# Altium schematic sheet SD.SchDoc
size A; SheetNumber: 4; SheetTotal: 9
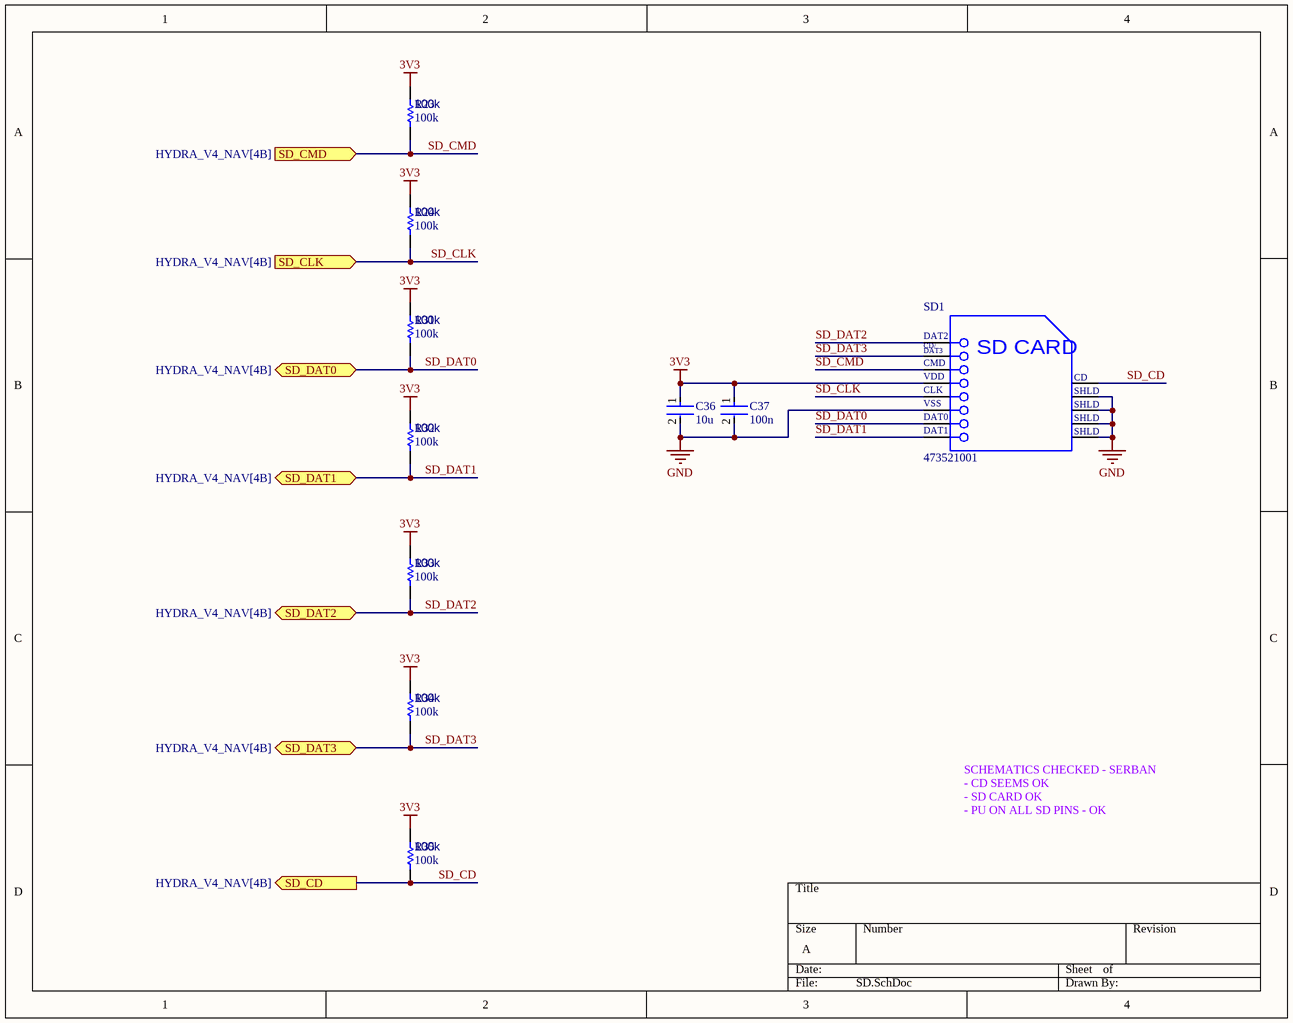
[diagram p0: SD.SchDoc]

## Parts
C36  10u  [FP-0402-L_1_0_0_05-W_0_5-IPC_A]
C37  100n  [FP-0402-L_1_0_0_05-W_0_5-IPC_A]
R23  100k  [R0603B]
R24  100k  [R0603B]
R31  100k  [R0603B]
R32  100k  [R0603B]
R33  100k  [R0603B]
R34  100k  [R0603B]
R35  100k  [R0603B]
SD1  473521001  [MOLX-473521001_V]

## Ports
SD_CD (out, see HYDRA_V4_NAV[4B]), SD_CLK (in, see HYDRA_V4_NAV[4B]), SD_CMD (in, see HYDRA_V4_NAV[4B]), SD_DAT0 (bidir, see HYDRA_V4_NAV[4B]), SD_DAT1 (bidir, see HYDRA_V4_NAV[4B]), SD_DAT2 (bidir, see HYDRA_V4_NAV[4B]), SD_DAT3 (bidir, see HYDRA_V4_NAV[4B])

## Nets
3V3: C36.1 C37.1 R23.1 R24.1 R31.1 R32.1 R33.1 R34.1 R35.1 SD1.4(VDD)
GND: C36.2 C37.2 SD1.6(VSS) SD1.10(SHLD) SD1.11(SHLD) SD1.12(SHLD) SD1.13(SHLD)
SD_CD: R35.2 SD1.9(CD) ; port SD_CD
SD_CLK: R24.2 SD1.5(CLK) ; port SD_CLK
SD_CMD: R23.2 SD1.3(CMD) ; port SD_CMD
SD_DAT0: R31.2 SD1.7(DAT0) ; port SD_DAT0
SD_DAT1: R32.2 SD1.8(DAT1) ; port SD_DAT1
SD_DAT2: R33.2 SD1.1(DAT2) ; port SD_DAT2
SD_DAT3: R34.2 SD1.2(CD/DAT3) ; port SD_DAT3

## Notes on the sheet
- SCHEMATICS CHECKED - SERBAN
  - CD SEEMS OK
  - SD CARD OK
  - PU ON ALL SD PINS - OK
- (in symbol CMP-2000-05848-1) CD/; DAT3; SD CARD

## Library data of the parts
C36 C37 = CMP-001-00058-1: LARGE PADS, 0402 CAP, CHANGE COMMENT TO MATCH REAL P/N; Capacitor Type: Ceramic; Min Operating Temperature: -55°C; Mounting Technology: Surface Mount; Pins: 2; Case/Package: 0402; RoHS Compliant: Yes; Max Operating Temperature: 85°C
  C36: Value: 10u
  C37: Value: 100n
R23 R24 R31-R35 = CMP-009-00002-14: Resistor; Value: 100k
SD1 = CMP-2000-05848-1: MicroSD(TM), Pitch 1.1 mm, 8 Position, Height 1.88 mm, -20 to 85 degC, RoHS, Tape and Reel; Manufacturer: Molex; Datasheet Version: Rev. G, 01/2012; Datasheet URL: http://www.molex.com/pdm_docs/sd/473521001_sd.pdf; Package Reference: 473521001; Manufacturer URL: http://www.molex.com/; Mounting Technology: SurfaceMount; Package Description: MicroSD(TM), Pitch 1.1 mm, 8 Position, Height 1.88 mm